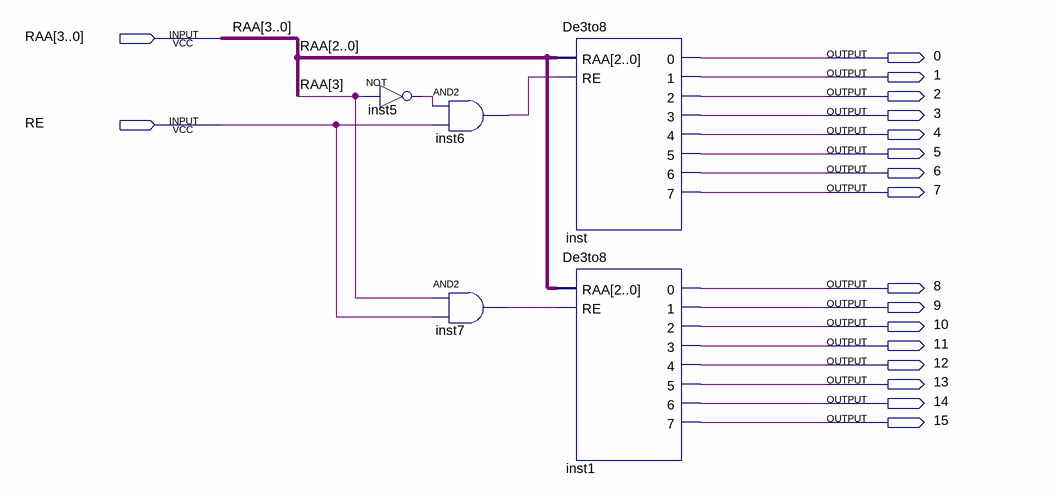
[diagram p0: schematic sheet]
// Quartus schematic De4to16.bdf as structural Verilog: 5 symbols, 18 pins
module De4to16 (
  input  [3:0] RAA,
  input  RE,
  output \0 ,
  output \1 ,
  output \2 ,
  output \3 ,
  output \4 ,
  output \5 ,
  output \6 ,
  output \7 ,
  output \8 ,
  output \9 ,
  output \10 ,
  output \11 ,
  output \12 ,
  output \13 ,
  output \14 ,
  output \15 
);

  wire inst5_out, inst6_out, inst7_out;

  not inst5 (inst5_out, RAA[3]);
  and inst6 (inst6_out, inst5_out, RE);
  and inst7 (inst7_out, RAA[3], RE);
  De3to8 inst (
    .RAA(RAA[2:0]), .RE(inst6_out), .\0 (\0 ), .\1 (\1 ), .\2 (\2 ), .\3 (\3 ), .\4 (\4 ), .\5 (\5 ),
    .\6 (\6 ), .\7 (\7 ));
  De3to8 inst1 (
    .RAA(RAA[2:0]), .RE(inst7_out), .\0 (\8 ), .\1 (\9 ), .\2 (\10 ), .\3 (\11 ), .\4 (\12 ), .\5 (\13 ),
    .\6 (\14 ), .\7 (\15 ));
endmodule
